# Altium project RPi-CM-Lite.PrjPcb (part 4 of 5)

## Sheet CVBS2MIPI.SchDoc
size A3; SheetNumber: 6; SheetTotal: 7
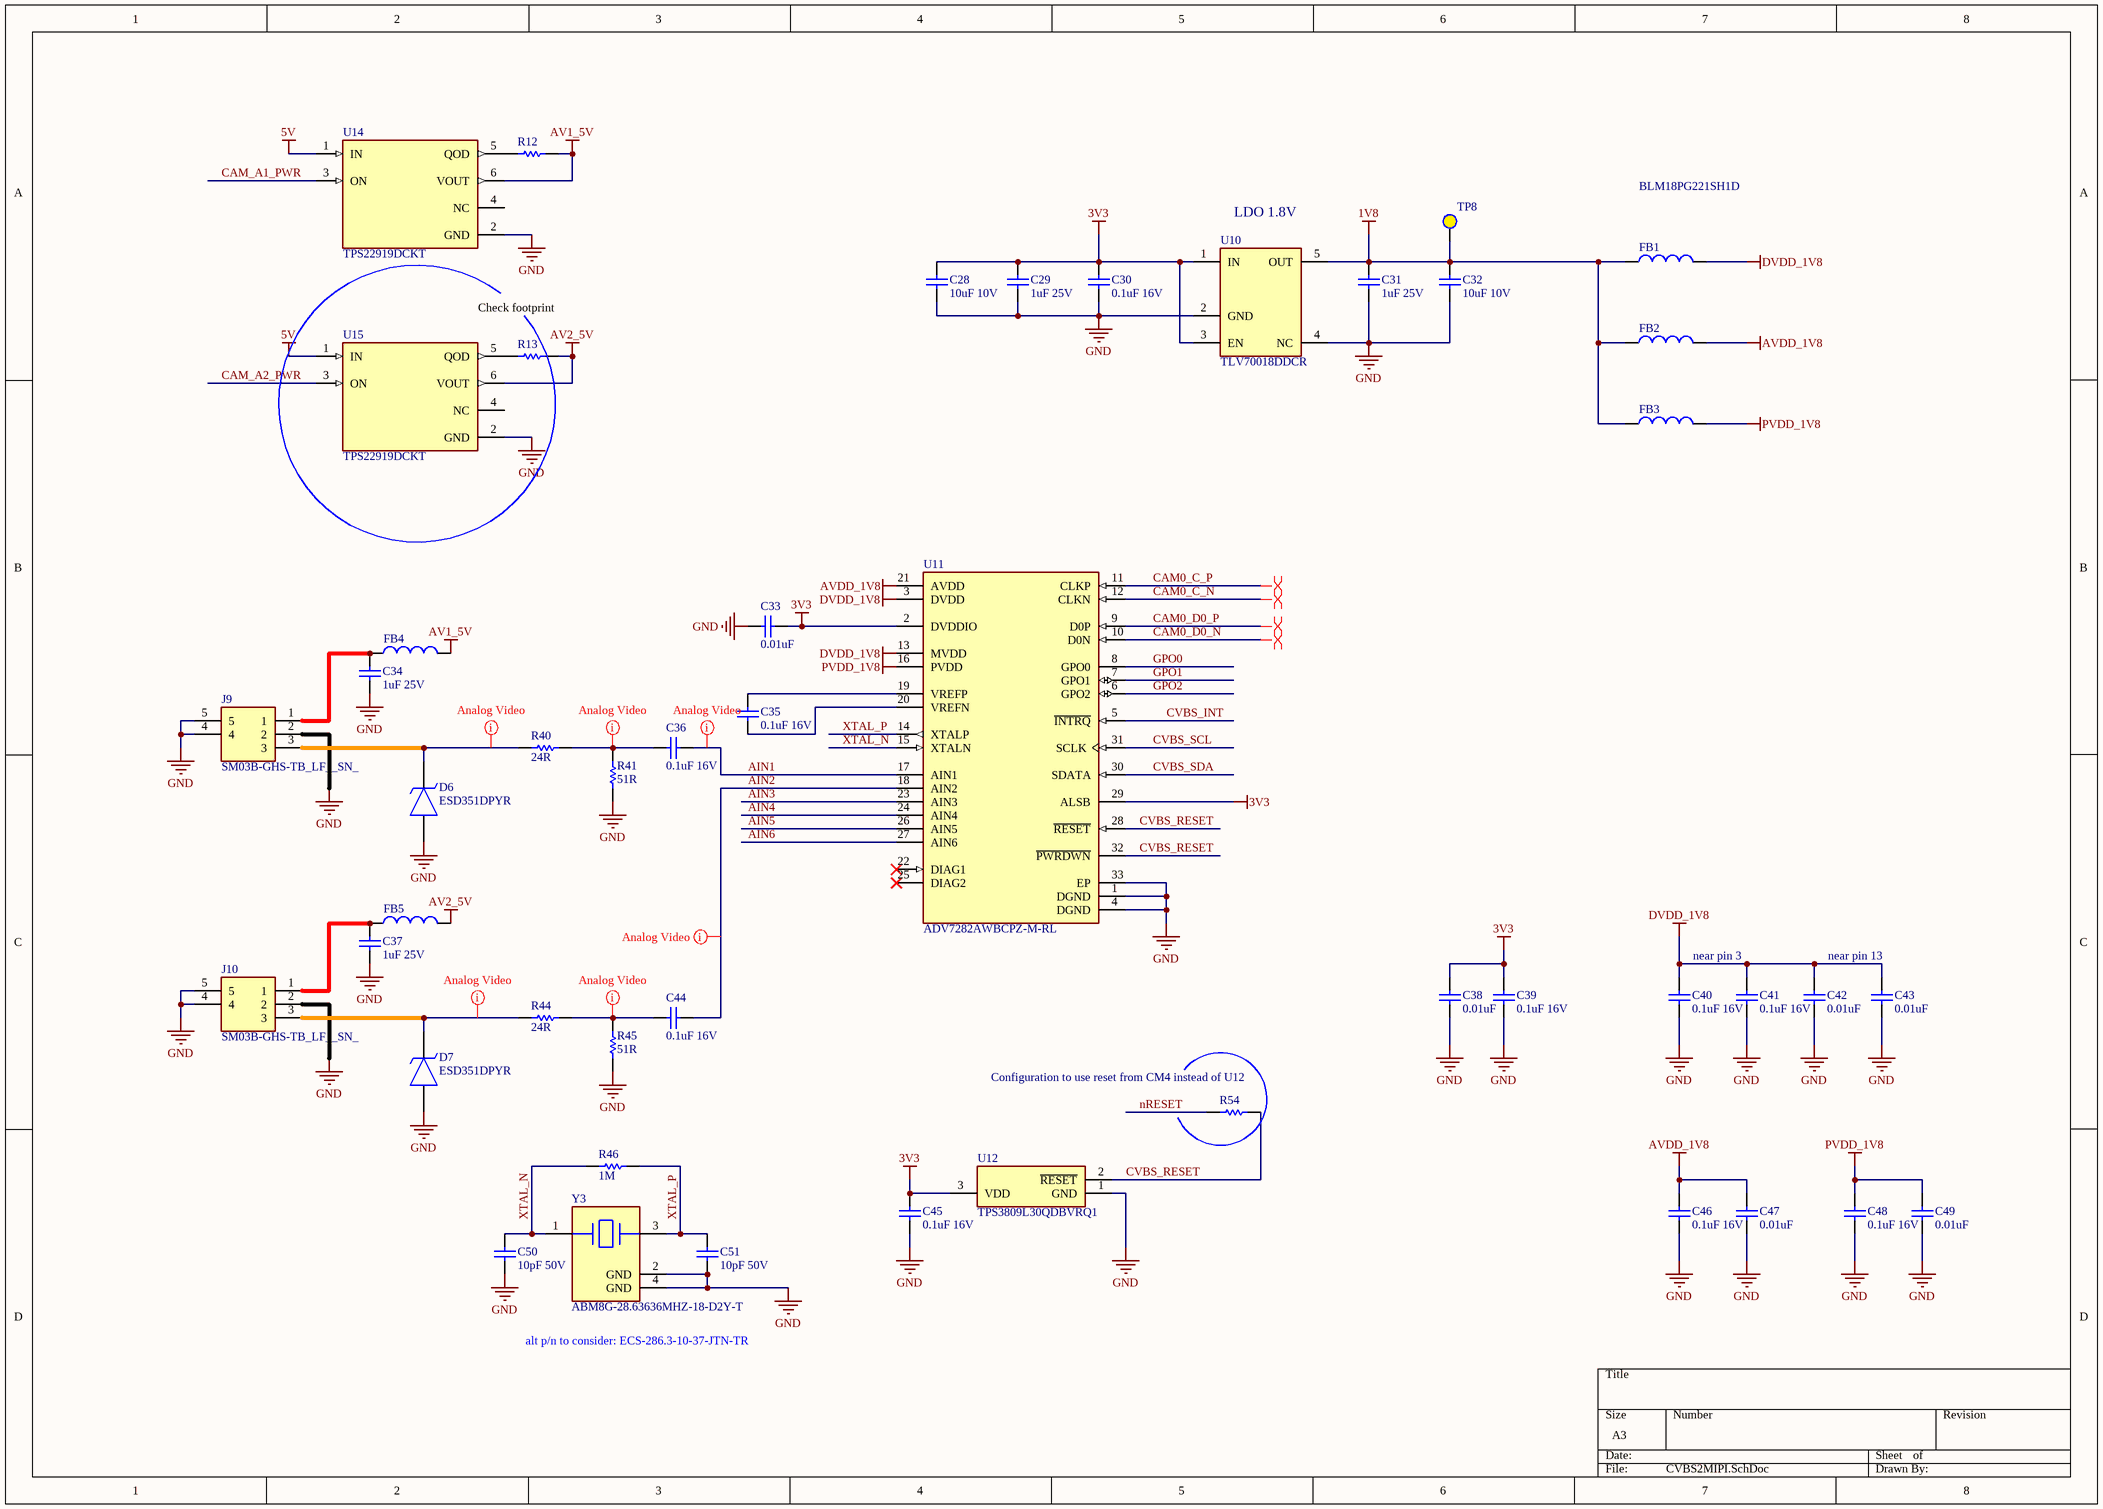
[diagram p5: CVBS2MIPI.SchDoc]

### Parts
C28  10uF 10V  [1608[0603]]
C29  1uF 25V  [1608[0603]H05]
C30  0.1uF 16V  [0402]
C31  1uF 25V  [1608[0603]H05]
C32  10uF 10V  [1608[0603]]
C33  0.01uF  [0402]
C34  1uF 25V  [1608[0603]H05]
C35  0.1uF 16V  [0402]
C36  0.1uF 16V  [0402]
C37  1uF 25V  [1608[0603]H05]
C38  0.01uF  [0402]
C39  0.1uF 16V  [0402]
C40  0.1uF 16V  [0402]
C41  0.1uF 16V  [0402]
C42  0.01uF  [0402]
C43  0.01uF  [0402]
C44  0.1uF 16V  [0402]
C45  0.1uF 16V  [0402]
C46  0.1uF 16V  [0402]
C47  0.01uF  [0402]
C48  0.1uF 16V  [0402]
C49  0.01uF  [0402]
C50  10pF 50V  [0402]
C51  10pF 50V  [0402]
D6  ESD351DPYR  [UCLAMP2501TTCT]
D7  ESD351DPYR  [UCLAMP2501TTCT]
FB1  FerriteBead_120Ohm_2A_0603  [1608[0603]H05]  (value not drawn)
FB2  FerriteBead_120Ohm_2A_0603  [1608[0603]H05]  (value not drawn)
FB3  FerriteBead_120Ohm_2A_0603  [1608[0603]H05]  (value not drawn)
FB4  FerriteBead_120Ohm_2A_0603  [1608[0603]H05]  (value not drawn)
FB5  FerriteBead_120Ohm_2A_0603  [1608[0603]H05]  (value not drawn)
J9  SM03B-GHS-TB_LF__SN_  [SM03BGHSTBLFSN]
J10  SM03B-GHS-TB_LF__SN_  [SM03BGHSTBLFSN]
R12  0R  [0402]  (value not drawn)
R13  0R  [0402]  (value not drawn)
R40  24R  [0402]
R41  51R  [0402]
R44  24R  [0402]
R45  51R  [0402]
R46  1M  [0402]
R54  0R  [0402]  (value not drawn)
TP8  TESTPOINT  [TESTPOINT_0.9]  (value not drawn)  (no BOM)
U10  TLV70018DDCR  [SOT95P280X110-5N]
U11  ADV7282AWBCPZ-M-RL  [FP-CP-32-12-IPC_C]
U12  TPS3809L30QDBVRQ1  [SOT95P280X145-3N]
U14  TPS22919DCKT  [FP-DCK0006A-MFG]
U15  TPS22919DCKT  [FP-DCK0006A-MFG]
Y3  ABM8G-28.63636MHZ-18-D2Y-T  [FP-ABM8G-MFG]

### Nets
1V8: C31.2 C32.2 FB1.1 FB2.1 FB3.1 TP8.1 U10.5(OUT)
3V3: C28.2 C29.2 C30.1 C33.1 C38.2 C39.1 C45.1 U10.1(IN) U10.3(EN) U11.2(DVDDIO) U11.29(ALSB) U12.3(VDD)
5V: U14.1(IN) U15.1(IN)
AV1_5V: FB4.2 R12.2 U14.6(VOUT)
AV2_5V: FB5.2 R13.2 U15.6(VOUT)
AVDD_1V8: C46.1 C47.2 FB2.2 U11.21(AVDD)
DVDD_1V8: C40.1 C41.1 C42.2 C43.2 FB1.2 U11.3(DVDD) U11.13(MVDD)
GND: C28.1 C29.1 C30.2 C31.1 C32.1 C33.2 C34.1 C37.1 C38.1 C39.2 C40.2 C41.2 C42.1 C43.1 C45.2 C46.2 C47.1 C48.2 C49.1 C50.1 C51.1 D6.1(A) D7.1(A) J9.2 J9.4 J9.5 J10.2 J10.4 J10.5 R41.1 R45.1 U10.2(GND) U10.4(NC) U11.1(DGND) U11.4(DGND) U11.33(EP) U12.1(GND) U14.2(GND) U15.2(GND) Y3.2(GND) Y3.4(GND)
PVDD_1V8: C48.1 C49.2 FB3.2 U11.16(PVDD)
AIN1: C36.1 U11.17(AIN1)
AIN2: C44.1 U11.18(AIN2)
AIN3: U11.23(AIN3)
AIN4: U11.24(AIN4)
AIN5: U11.26(AIN5)
AIN6: U11.27(AIN6)
CAM0_C_N: U11.12(CLKN)
CAM0_C_P: U11.11(CLKP)
CAM0_D0_N: U11.10(D0N)
CAM0_D0_P: U11.9(D0P)
CAM_A1_PWR: U14.3(ON)
CAM_A2_PWR: U15.3(ON)
CVBS_INT: U11.5(~{INTRQ})
CVBS_RESET: R54.2 U11.28(~{RESET}) U11.32(~{PWRDWN}) U12.2(~{RESET})
CVBS_SCL: U11.31(SCLK)
CVBS_SDA: U11.30(SDATA)
GPO0: U11.8(GPO0)
GPO1: U11.7(GPO1)
GPO2: U11.6(GPO2)
nRESET: R54.1
XTAL_N: C50.2 R46.1 U11.15(XTALN) Y3.1
XTAL_P: C51.2 R46.2 U11.14(XTALP) Y3.3
NetC34_2: C34.2 FB4.1 J9.1
NetC35_1: C35.1 U11.19(VREFP)
NetC35_2: C35.2 U11.20(VREFN)
NetC36_2: C36.2 R40.2 R41.2
NetC37_2: C37.2 FB5.1 J10.1
NetC44_2: C44.2 R44.2 R45.2
NetD6_2: D6.2(K) J9.3 R40.1
NetD7_2: D7.2(K) J10.3 R44.1
NetR12_1: R12.1 U14.5(QOD)
NetR13_1: R13.1 U15.5(QOD)

Not connected (* = marked no-connect by the designer): U11 22(DIAG1)* 25(DIAG2)*; U14 4(NC); U15 4(NC)

### Layout directives
differential pair: CAM0_C_N, CAM0_C_P, CAM0_D0_N, CAM0_D0_P
net class AV: AIN1, AIN2, NetC36_2, NetC44_2, NetD6_2, NetD7_2

### Notes on the sheet
- (near U10) LDO 1.8V
- BLM18PG221SH1D
- Check footprint
- near pin 3
- near pin 13
- (near R54) Configuration to use reset from CM4 instead of U12
- alt p/n to consider: ECS-286.3-10-37-JTN-TR

### Library data of the parts
C28 C32 = Cap10UF_10V_0603: Ceramic Capacitor (Surface Mount) Low ESL; Manufacturer: TDK; Manufacturer Part Number: C1608X5R1A106M080AC; Tolerance: 20%; Dielectric: X5R; Supplier 1: Digi-Key; Stock 1: 549066; Pricing 1: 1=0.43, 10=0.298, 100=0.1785, 500=0.1339, 1000=0.1131 (USD); Mount: Surface Mount; Case/Package: 0603; Number of Pins: 2; Weight: 7.1E-05oz; Case Code (Metric): 1608; Case Code (Imperial): 0603; Dielectric Material: Ceramic; Min Operating Temperature: -55°C; Max Operating Temperature: 85°C; Capacitance: 10uF; Voltage Rating: 10V; Packaging: Tape and Reel; Package Quantity: 1; Voltage Rating (DC): 10V; Termination: SMD/SMT; Composition: Ceramic; Length: 1.6mm; Height: 0.8mm; Width: 0.031inch; Thickness: 0.035inch; Depth: 0.8mm; Radiation Hardening: No; REACH SVHC: No SVHC; Lead Free: Lead Free; ComponentLink1URL: https://datasheet.ciiva.com/15192/getdatasheetpartid-722046-15192006.pdf; ComponentLink1Description: https://datasheet.ciiva.com/15192/getdatasheetpartid-722046-15192006.pdf; ComponentLink2URL: https://datasheet.ciiva.com/17487/e412-c-17487513.pdf; ComponentLink2Description: https://datasheet.ciiva.com/17487/e412-c-17487513.pdf; ComponentLink3URL: https://datasheet.ciiva.com/24312/2958c1608x5r1a106m080ac-24312391.pdf; ComponentLink3Description: https://datasheet.ciiva.com/24312/2958c1608x5r1a106m080ac-24312391.pdf; ComponentLink4URL: https://datasheet.ciiva.com/16508/e412-c-16508686.pdf; ComponentLink4Description: https://datasheet.ciiva.com/16508/e412-c-16508686.pdf; ComponentLink5URL: https://datasheet.ciiva.com/22749/1744655-22749594.pdf; ComponentLink5Description: https://datasheet.ciiva.com/22749/1744655-22749594.pdf; ComponentLink6URL: https://datasheet.ciiva.com/36857/1796654-36857302.pdf; ComponentLink6Description: https://datasheet.ciiva.com/36857/1796654-36857302.pdf; ComponentLink7URL: https://datasheet.ciiva.com/6288/tdkmlcccaprange-6288534.pdf; ComponentLink7Description: https://datasheet.ciiva.com/6288/tdkmlcccaprange-6288534.pdf; ComponentLink8URL: https://datasheet.ciiva.com/22676/639999-22676919.pdf; ComponentLink8Description: https://datasheet.ciiva.com/22676/639999-22676919.pdf; ComponentLink9URL: https://datasheet.ciiva.com/48671/e412-c-48671302.pdf; ComponentLink9Description: https://datasheet.ciiva.com/48671/e412-c-48671302.pdf; Supplier Part Number 1: 445-6853-1-ND
C29 C31 C34 C37 = Cap1UF_25V_0603: Cap Ceramic 1uF 25V X5R 10% 0603; Manufacturer: Samsung; Manufacturer Part Number: CL10A105KA8NNNC; Supplier 1: Digi-Key; RoHS: Yes; Packaging: Tape and Reel; Capacitance: 1uF; Tolerance: 10%; ComponentLink1URL: https://datasheet.ciiva.com/25801/cl10a105ka8nnnc-25801364.pdf?src-supplier=Digi-Key; ComponentLink1Description: https://datasheet.ciiva.com/25801/cl10a105ka8nnnc-25801364.pdf?src-supplier=Digi-Key; Supplier Part Number 1: 1276-1858-1-ND; Supplier 2: Digi-Key; Stock 2: 4227112; Pricing 2: 1=0,10000, 10=0,04100, 100=0,01850, 500=0,01320, 1000=0,01037 (USD); Mount: Surface Mount; Case/Package: 0603; Case Code (Metric): 1608; Case Code (Imperial): 0603; Material: Ceramic; Contact Plating: Tin; Min Operating Temperature: -55°C; Max Operating Temperature: 85°C; Dielectric: X5R; Voltage: 25V; Voltage Rating (DC): 25V; Package Quantity: 1; Voltage Rating: 25V; Length: 1.6mm; Height: 0.8mm; Depth: 0.8mm; Width: 0.031inch; Thickness: 0.035inch; Radiation Hardening: No; Lead Free: Lead Free; ComponentLink2URL: https://datasheet.ciiva.com/26838/getdatasheetpartid-357530-26838332.pdf?src-supplier=Verical; ComponentLink2Description: https://datasheet.ciiva.com/26838/getdatasheetpartid-357530-26838332.pdf?src-supplier=Verical; ComponentLink3URL: https://datasheet.ciiva.com/29198/458162-da-01-en-vs-kondensator-0603-29198475.pdf?src-supplier=Conrad; ComponentLink3Description: https://datasheet.ciiva.com/29198/458162-da-01-en-vs-kondensator-0603-29198475.pdf?src-supplier=Conrad; Supplier Part Number 2: 1276-1102-1-ND
C30 C35 C36 C39-C41 C44-C46 C48 = Cap0.1UF_16V_X7R: 0402 0.1 uF 16V ±10% Tolerance X7R SMT Multilayer Ceramic Capacitor; Manufacturer: Murata; Manufacturer Part Number: GCM155R71C104KA55J; Value: 100nF; RoHS: Yes; Category: Ceramic Capacitors; Stock 1: 2121057; Pricing 1: 1=0,10000, 10=0,01800, 50=0,01800, 100=0,01500, 1000=0,00900, 10000=0,00700 (USD); Mounting Technology: Surface Mount; Case/Package: 0402; Case Code (Imperial): 0402; Case Code (Metric): 1005; Min Operating Temperature: -55°C; Max Operating Temperature: 125°C; Tolerance: 10%; Voltage Rating: 16V; Voltage Rating (DC): 16V; Packaging: Tape and Reel; Package Quantity: 1; Dielectric: X7R; Termination: SMD/SMT; Series: GCM; Construction: Flat; Length: 1mm; Width: 0.5mm; Height: 0.5mm; Thickness: 0.022inch; Depth: 0.5mm; Ratings: AEC-Q200; Radiation Hardening: No; Lead Free: Lead Free; RoHS Compliant: Yes; ComponentLink1URL: https://datasheet.ciiva.com/11618/product-11618848.pdf?src-supplier=Avnet; ComponentLink1Description: https://datasheet.ciiva.com/11618/product-11618848.pdf?src-supplier=Avnet; ComponentLink2URL: https://datasheet.ciiva.com/16440/gcm155r71c104ka55j-16440393.pdf?src-supplier=Future+Electronics; ComponentLink2Description: https://datasheet.ciiva.com/16440/gcm155r71c104ka55j-16440393.pdf?src-supplier=Future+Electronics; ComponentLink3URL: https://datasheet.ciiva.com/29542/product-29542474.pdf?src-supplier=Digi-Key; ComponentLink3Description: https://datasheet.ciiva.com/29542/product-29542474.pdf?src-supplier=Digi-Key; ComponentLink4URL: https://datasheet.ciiva.com/29542/product-29542475.pdf?src-supplier=Digi-Key; ComponentLink4Description: https://datasheet.ciiva.com/29542/product-29542475.pdf?src-supplier=Digi-Key; Supplier 1: Mouser; Supplier 2: Digi-Key; Supplier Part Number 1: 81-GCM155R71C104KA5J; Supplier Part Number 2: 490-7998-1-ND
C33 C38 C42 C43 C47 C49 = Cap0.01UF_25V: Ceramic Capacitor (Surface Mount); ComponentLink1URL: http://product.tdk.com/en/catalog/datasheets/mlcc_commercial_general_en.pdf; ComponentLink1Description: http://product.tdk.com/en/catalog/datasheets/mlcc_commercial_general_en.pdf; Supplier 1: Mouser; Supplier Part Number 1: 81-GCM155R71H103KA5J
C50 C51 = Cap10PF_50V: Ceramic Capacitor (Surface Mount); Manufacturer: Kemet; Manufacturer Part Number: CBR04C100J5GAC; Tolerance: ±5%; Temperature Coefficient: C0G, NP0; Supplier 1: Digi-Key; RoHS: RoHS Compliant; Category: Capacitors; Stock 1: 19679; Pricing 1: 1=0.12, 10=0.086, 25=0.0644, 50=0.0492, 100=0.0407, 250=0.03428, 1000=0.0231, 2500=0.02121, 5000=0.01953 (USD); Packaging: Cut Tape (CT); Capacitance: 10pF; Voltage - Rated: 50V; Mounting Type: Surface Mount, MLCC; Operating Temperature: -55°C ~ 125°C; Applications: RF, Microwave, High Frequency; Ratings: -; Package / Case: 0402 (1005 Metric); Size / Dimension: 0.039" L x 0.020" W (1.00mm x 0.50mm); Height - Seated (Max): -; Thickness (Max): 0.022" (0.55mm); Lead Spacing: -; Features: High Q, Low Loss; Lead Style: -; ComponentLink1URL: http://www.kemet.com/Lists/ProductCatalog/Attachments/490/KEM_C1030_CBR_SMD.pdf; ComponentLink1Description: http://www.kemet.com/Lists/ProductCatalog/Attachments/490/KEM_C1030_CBR_SMD.pdf; Supplier Part Number 1: 399-6168-1-ND
D6 D7 = ESD351DPYR: 1-channel 30 k-V ESD protection diode with low clamping -Voltage in 0402 Package 2-X1SON -40 to 125; Manufacturer: Texas Instruments; Direction: 210Direction; Interface: 224Interface; Value: 1.8pF; Height: 450um; Supplier: Mouser; Supplier Part Number: 595-ESD351DPYR; Manufacturer Part Number: ESD351DPYR; RoHS: Yes; Category: ESD and Circuit Protection ICs; Stock: 138971; Pricing: 1=0.27, 10=0.183, 50=0.183, 100=0.078, 1000=0.07, 10000=0.068 (USD); Pins: 2NUMBER; ComponentLink1URL: http://www.ti.com/lit/ds/symlink/esd351.pdf?src-supplier=Digikey; ComponentLink1Description: http://www.ti.com/lit/ds/symlink/esd351.pdf?src-supplier=Digikey; Supplier 1: Mouser; Supplier Part Number 1: 595-ESD351DPYR; Length: 600um; Width: 1mm; Thickness: 370um; ComponentLink2URL: http://www.ti.com/general/docs/suppproductinfo.tsp?distId=10&amp;gotoUrl=http%3A%2F%2Fwww.ti.com%2Flit%2Fgpn%2Fesd351&src-supplier=Digikey; ComponentLink2Description: http://www.ti.com/general/docs/suppproductinfo.tsp?distId=10&amp;gotoUrl=http%3A%2F%2Fwww.ti.com%2Flit%2Fgpn%2Fesd351&src-supplier=Digikey
FB1-FB5 = FerriteBead_120Ohm_2A_0603: FERRITE BEAD 120 OHM 0603 1LN; Manufacturer: TDK; Manufacturer Part Number: MPZ1608S121ATAH0; Tolerance: 25%; Impedance: 120R; DC Resistance (DCR): 45mR; Current Rating: 2A; Supplier 1: Mouser; RoHS: Yes; Category: Inductors; Stock 1: 48370; Pricing 1: 1=0,10000, 10=0,05900, 50=0,05900, 100=0,03200, 1000=0,02500, 10000=0,02100 (USD); Mount: Surface Mount; Case/Package: 0603; Core Material: Ferrite; Case Code (Metric): 1608; Case Code (Imperial): 0603; Package Quantity: 4000; Packaging: Tape and Reel; Max DC Current: 2A; Length: 0.063inch; Width: 0.031inch; Height: 0.03inch; Depth: 0.8mm; RoHS Compliant: Yes; ComponentLink1URL: https://datasheet.ciiva.com/46634/beads-commercial-power-mpz-en-46634726.pdf?src-supplier=Digi-Key; ComponentLink1Description: https://datasheet.ciiva.com/46634/beads-commercial-power-mpz-en-46634726.pdf?src-supplier=Digi-Key; ComponentLink2URL: https://datasheet.ciiva.com/46634/beads-commercial-power-mpz-en-46634728.pdf?src-supplier=Digi-Key; ComponentLink2Description: https://datasheet.ciiva.com/46634/beads-commercial-power-mpz-en-46634728.pdf?src-supplier=Digi-Key; ComponentLink3URL: https://datasheet.ciiva.com/48682/beads-commercial-power-mpz-en-48682494.pdf?src-supplier=Avnet; ComponentLink3Description: https://datasheet.ciiva.com/48682/beads-commercial-power-mpz-en-48682494.pdf?src-supplier=Avnet; Supplier Part Number 1: 810-MPZ1608S121ATAH0
J9 J10 = SM03B-GHS-TB_LF__SN_: Connector; Manufacturer_Name: JST (JAPAN SOLDERLESS TERMINALS); Manufacturer_Part_Number: SM03B-GHS-TB(LF)(SN); Manufacturer: JST; Gender: 29Gender; Datasheet Link: http://www.jst-mfg.com/product/pdf/eng/eGH.pdf; Arrow Part Number: SM03B-GHS-TB(LF)(SN); Arrow Price/Stock: https://www.arrow.com/en/products/sm03b-ghs-tb-lf-sn/jst-manufacturing; Supplier: Mouser; Supplier Part Number: 306-SM03BGHSTBLFSN; Manufacturer Part Number: SM03B-GHS-TB(LF)(SN); RoHS: Yes; Category: Headers and Wire Housings; Stock: 4469; Pricing: 1=0.38, 10=0.309, 50=0.309, 100=0.252, 1000=0.206, 10000=0.159 (USD); Housing Color: 50Colour; Housing Material: 4261ConductorMaterial; Lead Free: 5697LeadFree; ComponentLink1URL: https://datasheet.ciiva.com/25617/0900766b810cef18-25617270.pdf?src-supplier=Rs; ComponentLink1Description: https://datasheet.ciiva.com/25617/0900766b810cef18-25617270.pdf?src-supplier=Rs; ComponentLink2URL: https://datasheet.ciiva.com/8052/5438-8052261.pdf?src-supplier=Element14; ComponentLink2Description: https://datasheet.ciiva.com/8052/5438-8052261.pdf?src-supplier=Element14; ComponentLink3URL: https://datasheet.ciiva.com/16379/jstsm03b-ghs-tb-lf-sn-16379590.pdf?src-supplier=Future+Electronics; ComponentLink3Description: https://datasheet.ciiva.com/16379/jstsm03b-ghs-tb-lf-sn-16379590.pdf?src-supplier=Future+Electronics; Supplier 1: Mouser; Supplier Part Number 1: 306-SM03BGHSTBLFSN
R12 R13 R54 = Res_0R_0402: Zero ohm Jumper 0402; Manufacturer: Yageo; Manufacturer Part Number: RC0402JR-070RL; Resistance (Ohms): 0.0; Power (Watts): 0.063W, 1/16W; Value: 0R; Supplier 1: Digi-Key; RoHS: RoHS Compliant; Category: Resistors; Stock 1: 12447313; Pricing 1: 1=0.1, 10=0.013, 25=0.0092, 100=0.0053, 250=0.004, 500=0.0032, 1000=0.00236, 2500=0.00205, 5000=0.00169 (USD); Packaging: Cut Tape (CT); Tolerance: Jumper; Composition: Thick Film; Features: Moisture Resistant; Temperature Coefficient: -; Operating Temperature: -55°C ~ 155°C; Package / Case: 0402 (1005 Metric); Supplier Device Package: 0402; Size / Dimension: 0.039" L x 0.020" W (1.00mm x 0.50mm); Height: 0.016" (0.40mm); Number of Terminations: 2; ComponentLink1URL: http://www.yageo.com/documents/recent/PYu-RC_Group_51_RoHS_L_2.pdf; ComponentLink1Description: http://www.yageo.com/documents/recent/PYu-RC_Group_51_RoHS_L_2.pdf; Supplier Part Number 1: 311-0.0JRCT-ND; MountType: SMT
R40 R44 = Res_24R_0402: SMD Chip Resistor, 24 Ohm, ± 1%, 63 mW, 0402 [1005 Metric], Thick Film, General Purpose; Manufacturer: Yageo; Manufacturer Part Number: RC0402FR-0724RL; Voltage Rating: 50V; Power Rating: 63mW; Temperature Coefficient: 100ppm/°C; Supplier: Mouser; Supplier Part Number: 603-RC0402FR-0724RL; RoHS: Yes; Category: Chip SMD Resistors; Stock: 83277; Pricing: 1=0.1, 10=0.009, 50=0.009, 100=0.005, 1000=0.005, 10000=0.002 (USD); Case/Package: 0402; Pins: 2; Case Code (Imperial): 0402; Case Code (Metric): 1005; Min Operating Temperature: -55°C; Max Operating Temperature: 155°C; Packaging: Tape and Reel; Termination: SMD/SMT; Voltage Rating (DC): 50V; Working Voltage: 50V; Series: RC; Tolerance: 1%; Value: 24R; Resistor Type: Thick Film; Number of Terminations: 2; Max Power Dissipation: 63mW; Features: Moisture Resistant; Technology: THICK FILM; Construction: Rectangular; Resistance Tolerance: 1%; Length: 0.039inch; Width: 0.02inch; Height: 0.016inch; Depth: 0.5mm; Lead Free: Lead Free; RoHS Compliant: Yes; Reach SVHC Compliant: Unknown; Military Standard: Not; Supplier 1: Mouser; Supplier Part Number 1: 603-RC0402FR-0724RL
R41 R45 = Res_51R_0402: SMD Chip Resistor, 51 Ohm, ± 1%, 63 mW, 0402 [1005 Metric], Thick Film, General Purpose; Manufacturer: Yageo; Manufacturer Part Number: AC0402FR-0751RL; Power Rating: 62.5mW; Voltage Rating: 50V; Max Power Dissipation: 63mW; Temperature Coefficient: 100ppm/°C; Supplier: Mouser; Supplier Part Number: 603-AC0402FR-0751RL; RoHS: Yes; Category: Chip SMD Resistors; Stock: 74851; Pricing: 1=0.1, 10=0.008, 50=0.008, 100=0.005, 1000=0.004, 10000=0.002 (USD); Case/Package: 0402; Case Code (Imperial): 0402; Case Code (Metric): 1005; Min Operating Temperature: -55°C; Max Operating Temperature: 155°C; Tolerance: 1%; Packaging: Tape and Reel; Value: 51R; Number of Terminations: 2; Termination: SMD/SMT; Features: Moisture Resistant,Automotive AEC-Q200; Series: AC; Length: 0.039inch; Width: 0.5mm; Height: 0.015inch; Lead Free: Lead Free; RoHS Compliant: Yes; ComponentLink1URL: http://www.mouser.com/ds/2/447/yageodocoutput-1111992.pdf?src-supplier=Mouser; ComponentLink1Description: http://www.mouser.com/ds/2/447/yageodocoutput-1111992.pdf?src-supplier=Mouser; ComponentLink2URL: https://datasheet.octopart.com/AC0402FR-0751RL-Yageo-datasheet-166720450.pdf?src-supplier=Future+Electronics; ComponentLink2Description: https://datasheet.octopart.com/AC0402FR-0751RL-Yageo-datasheet-166720450.pdf?src-supplier=Future+Electronics; ComponentLink3URL: http://www.yageo.com/documents/recent/PYu-AC_51_RoHS_L_2_revised.pdf?src-supplier=Future+Electronics; ComponentLink3Description: http://www.yageo.com/documents/recent/PYu-AC_51_RoHS_L_2_revised.pdf?src-supplier=Future+Electronics; ComponentLink4URL: http://www.yageo.com/NewPortal/yageodocoutput?fileName=/pdf/R-Chip/PYu-AC_51_RoHS_L_6.pdf&src-supplier=Digikey; ComponentLink4Description: http://www.yageo.com/NewPortal/yageodocoutput?fileName=/pdf/R-Chip/PYu-AC_51_RoHS_L_6.pdf&src-supplier=Digikey; Supplier 1: Mouser; Supplier Part Number 1: 603-AC0402FR-0751RL
R46 = Res_1M_0402: Resistor; Manufacturer: Stackpole Electronics Inc; Manufacturer Part Number: RMCF0402FT1M00; Tolerance: ±1%; Power (Watts): 0.063W, 1/16W; Temperature Coefficient: ±100ppm/°C; Value: 1M; Supplier 1: Digi-Key; RoHS: RoHS Compliant; Category: Resistors; Stock 1: 197609; Pricing 1: 1=0.1, 10=0.025, 50=0.0138, 100=0.0105, 250=0.0078, 500=0.00576, 1000=0.00384, 2500=0.00324, 5000=0.0027 (USD); Packaging: Cut Tape (CT); Resistance (Ohms): 1M; Composition: Thick Film; Features: Automotive AEC-Q200; Operating Temperature: -55°C ~ 155°C; Package / Case: 0402 (1005 Metric); Supplier Device Package: 0402; Size / Dimension: 0.039" L x 0.020" W (1.00mm x 0.50mm); Height: 0.016" (0.40mm); Number of Terminations: 2; ComponentLink1URL: http://www.seielect.com/Catalog/SEI-RMCF_RMCP.pdf; ComponentLink1Description: http://www.seielect.com/Catalog/SEI-RMCF_RMCP.pdf; Supplier Part Number 1: RMCF0402FT1M00CT-ND; MountType: SMT
U10 = TLV70018DDCR: IC REG LINEAR 1.8V 200MA SOT23-5; Manufacturer_Name: Texas Instruments; Dropout Voltage: 175mV; Number of Outputs: 1; Max Power Dissipation: 500mW; Max Input Voltage: 5.5V; Min Input Voltage: 2V; Min Current Limit: 220mA; Polarity: Positive; Output Voltage Accuracy: 2%; Quiescent Current: 30uA; Output Type: Fixed; Datasheet Link: http://www.ti.com/lit/gpn/tlv700; Manufacturer_Part_Number: TLV70018DDCR; Mouser Part Number: 595-TLV70018DDCR; Mouser Price/Stock: https://www.mouser.com/Search/Refine.aspx?Keyword=595-TLV70018DDCR; Supplier 1: Mouser; Manufacturer: Texas Instruments; Manufacturer Part Number: TLV70018DDCR; RoHS: Yes; Category: Voltage Regulators - Linear; Stock 1: 3173; Pricing 1: 1=0,46000, 10=0,38000, 100=0,23400, 1000=0,18100, 3000=0,15400, 9000=0,14400, 24000=0,13600, 45000=0,13300, 99000=0,12800 (USD); Case/Package: SOT-5; Number of Pins: 5; Contact Plating: Gold; Min Operating Temperature: -40°C; Max Operating Temperature: 125°C; Output Voltage: 1.8V; Package Quantity: 1; Packaging: Tape and Reel; Output Current: 200mA; Max Output Current: 200mA; Number of Regulators: 1; Power Dissipation: 500mW; Accuracy: 2%; Max Output Voltage: 1.8V; Min Output Voltage: 1.8V; Nominal Output Voltage: 1.8V; Radiation Hardening: No; Lead Free: Lead Free; REACH SVHC: No SVHC; ComponentLink1URL: https://datasheet.ciiva.com/41462/001014632-da-01-en-ic-reg-ldo-1-8v-0-tlv70018ddcr-sot-5-tid-41462483.pdf?src-supplier=Conrad; ComponentLink1Description: https://datasheet.ciiva.com/41462/001014632-da-01-en-ic-reg-ldo-1-8v-0-tlv70018ddcr-sot-5-tid-41462483.pdf?src-supplier=Conrad; ComponentLink2URL: https://datasheet.ciiva.com/46448/1836520-46448748.pdf?src-supplier=Element14; ComponentLink2Description: https://datasheet.ciiva.com/46448/1836520-46448748.pdf?src-supplier=Element14; Supplier Part Number 1: 595-TLV70018DDCR
U11 = ADV7282A: Video Decoder 1ADC 10bit Automotive 32-Pin LFCSP EP T/R; Manufacturer: Analog Devices; Resolution: 10b; Number of Inputs: 6; RoHS Compliant: Yes; Supplier: Digikey; Supplier Part Number: 505-ADV7282AWBCPZ-M-RLCT-ND; Manufacturer Part Number: ADV7282AWBCPZ-M-RL; RoHS: Yes; Category: CODECs; Stock: 1147; Pricing: 1=19.8, 10=14.048, 25=12.5488, 100=11.3125, 5000=11.3125 (USD); Pins: 32; ComponentLink1URL: https://www.analog.com/media/en/technical-documentation/data-sheets/ADV7282A.pdf?src-supplier=Digikey; ComponentLink1Description: https://www.analog.com/media/en/technical-documentation/data-sheets/ADV7282A.pdf?src-supplier=Digikey; Supplier 1: Digikey; Supplier Part Number 1: 505-ADV7282AWBCPZ-M-RLCT-ND
U12 = TPS3809L30QDBVRQ1: Automotive, 3-pin voltage supervisor (reset IC) with active-low, push-pull reset 3-SOT-23 -40 to 125; Manufacturer_Name: Texas Instruments; Datasheet Link: https://datasheet.datasheetarchive.com/originals/distributors/Datasheets-302/22658.pdf; Height: 1.45mm; Manufacturer_Part_Number: TPS3809L30QDBVRQ1; Mouser Part Number: 595-TPS3809L30QDBVRQ; Mouser Price/Stock: https://www.mouser.co.uk/ProductDetail/Texas-Instruments/TPS3809L30QDBVRQ1?qs=M7j6iwOUn9waL2AuRy3QGQ%3D%3D; Arrow Part Number: TPS3809L30QDBVRQ1; Arrow Price/Stock: https://www.arrow.com/en/products/tps3809l30qdbvrq1/texas-instruments?region=nac; Supplier 1: Mouser; Manufacturer: Texas Instruments; Manufacturer Part Number: TPS3809L30QDBVRQ1; RoHS: Yes; Category: Voltage Supervisors; Stock 1: 5758; Pricing 1: 1=0.96, 10=0.861, 50=0.861, 100=0.671, 1000=0.438, 10000=0.365 (USD); ComponentLink1URL: https://datasheet.ciiva.com/1970/tps3809i50-q1-1970923.pdf?src-supplier=Digi-Key; ComponentLink1Description: https://datasheet.ciiva.com/1970/tps3809i50-q1-1970923.pdf?src-supplier=Digi-Key; Supplier Part Number 1: 595-TPS3809L30QDBVRQ
U14 U15 = CMP-04910-000077-1: IC PWR SWITCH N-CHAN 1:1 SC70-6
Y3 = Crystal_28.63636MHz: Crystal 28.63636MHz ±20ppm (Tol) ±30ppm (Stability) 18pF FUND 50Ω 4-Pin SMD T/R; ESR (Equivalent Series Resistance): 50R; Operating Frequency: 28.6 MHz; Length: 3.2mm; Lead Free: Lead Free; Width: 2.5mm; Termination: SMD/SMT; Series: ABM8G; Max Operating Temperature: 85°C; REACH SVHC: Yes; Mount: Surface Mount; Case/Package: SMD/SMT; Frequency Tolerance: 20ppm; Number of Pins: 4; Load Capacitance: 18pF; Tolerance: 20ppm; Series Resistance: 50R; Height: 1mm; Frequency: 28.63636MHz; Min Operating Temperature: -40°C; Frequency Stability: 30ppm; Package Quantity: 1000; Packaging: Tape and Reel; Radiation Hardening: No